# Altium project 机器人.PrjPcb
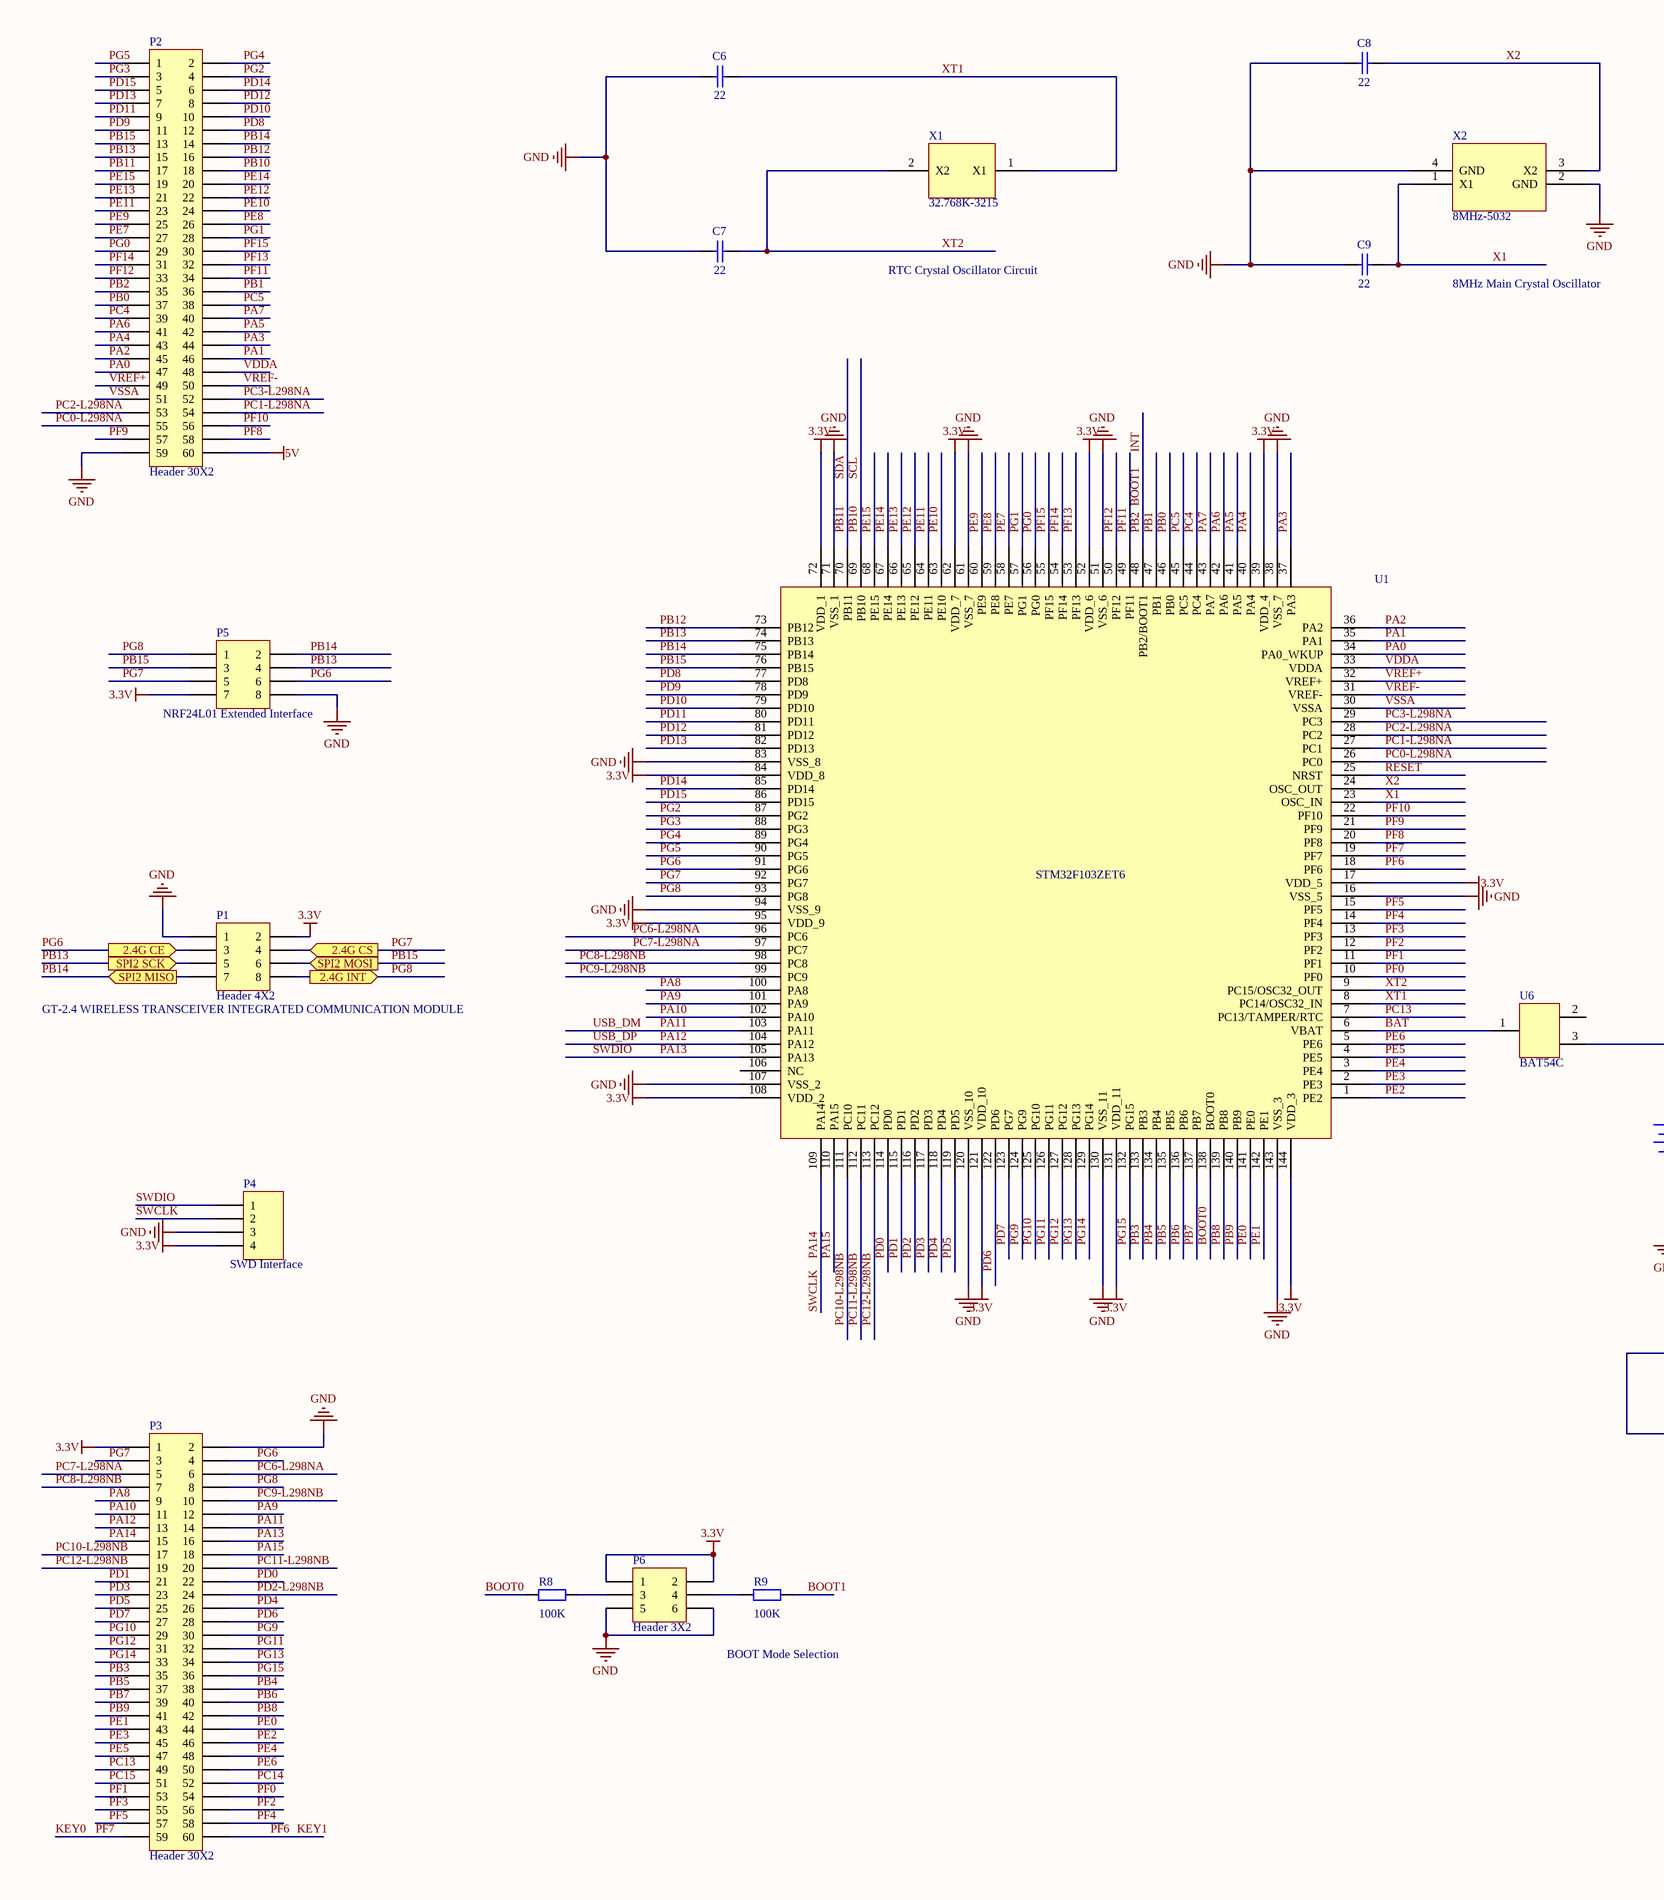
[diagram p0: 核心开发板.SchDoc, left]
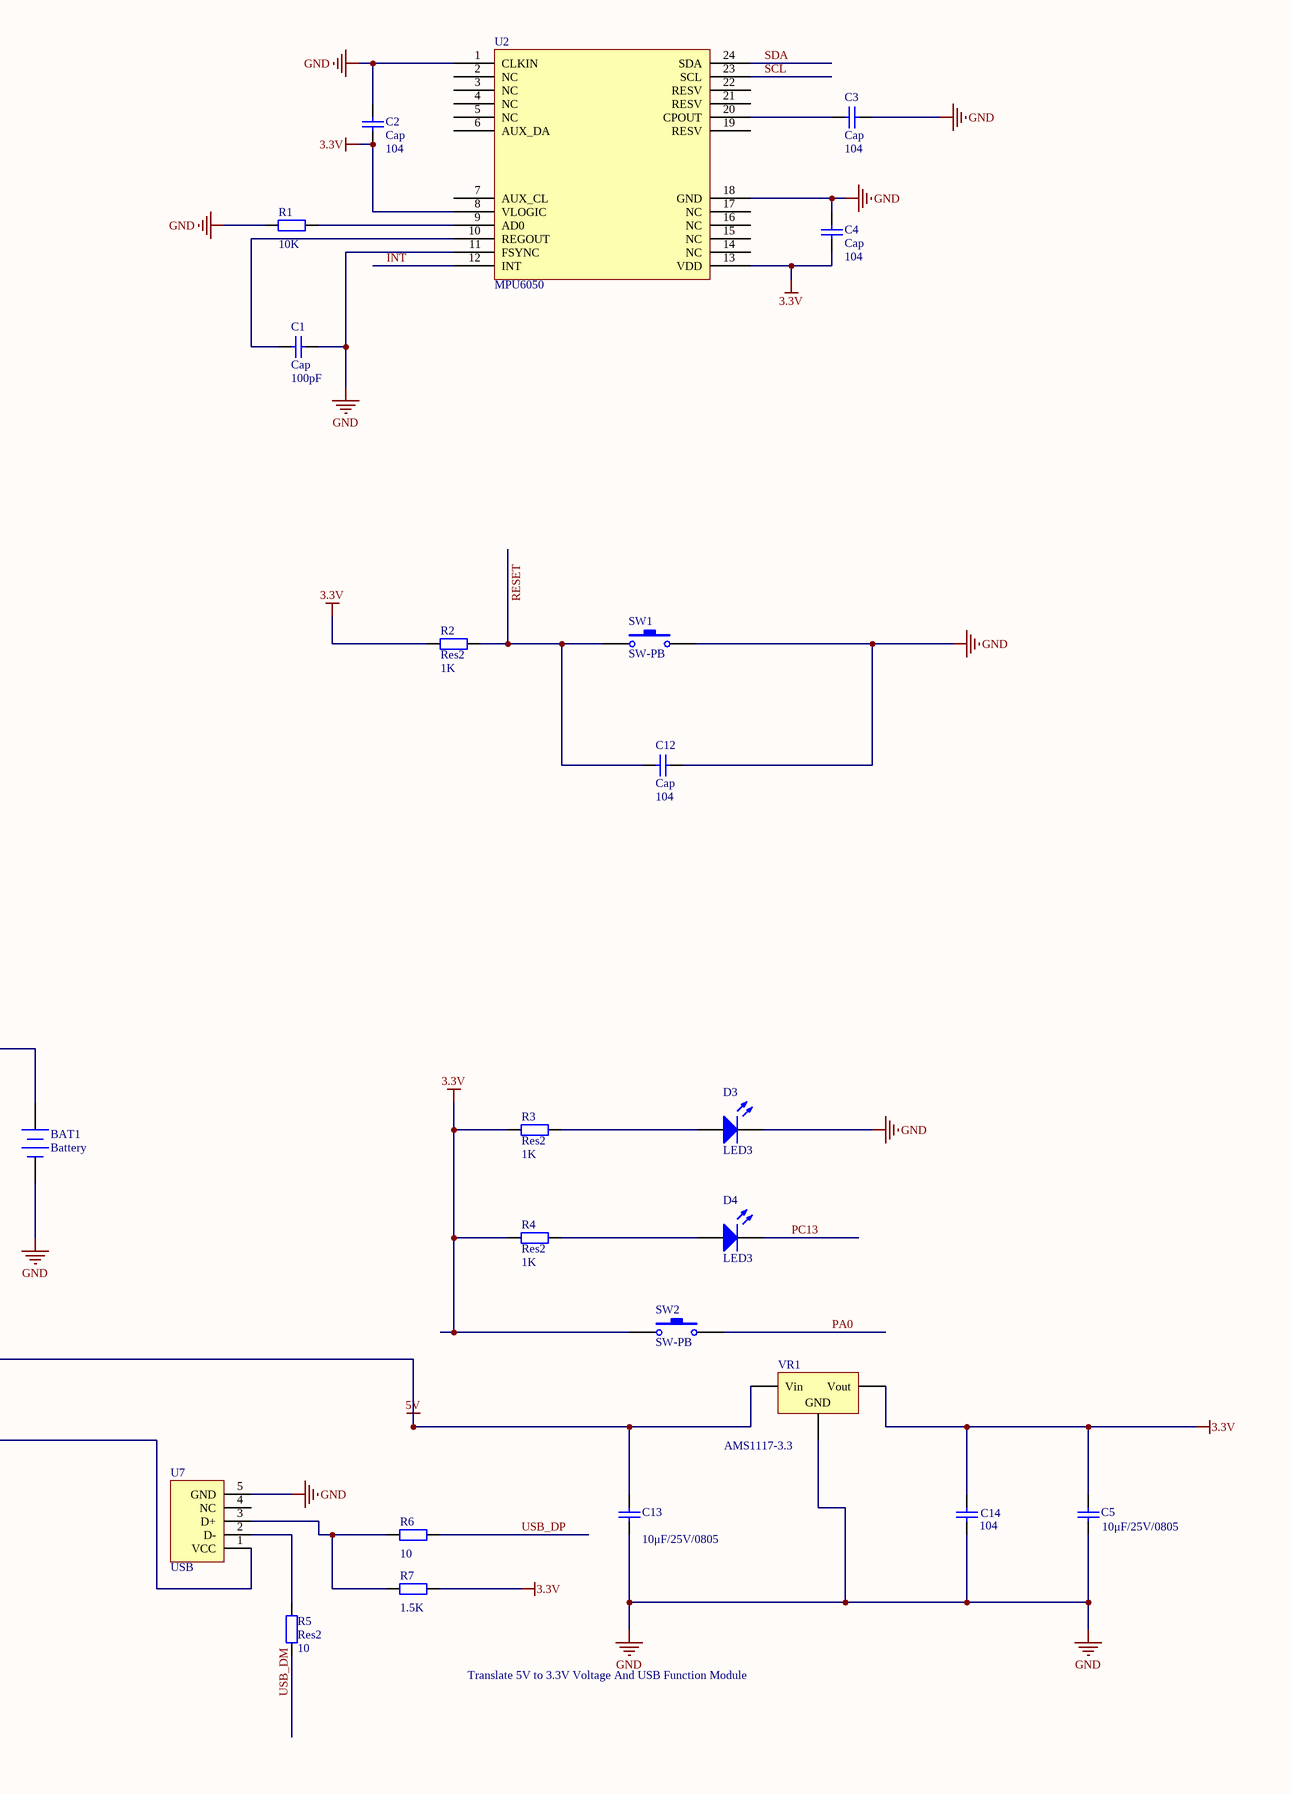
[diagram p1: 核心开发板.SchDoc, right]
2 sheets, 69 parts. Net scope: flat (ports and power ports of the same name join across sheets).
Board files: 开发板.PcbDoc, 驱动板.PcbDoc, 通信板.PcbDoc
Sheets:
  核心开发板.SchDoc
  嵌入式驱动模块.SchDoc

## Sheet 核心开发板.SchDoc
size A2

### Parts
BAT1  Battery  [HDR1X2]
C1  Cap  value 100pF  [0805_C]
C2  Cap  value 104  [0805_C]
C3  Cap  value 104  [0805_C]
C4  Cap  value 104  [0805_C]
C5  value 10μF/25V/0805  [0805_C]  (hidden comment: Cap)
C6  value 22  [0805_C]  (hidden comment: Cap)
C7  value 22  [0805_C]  (hidden comment: Cap)
C8  value 22  [0805_C]  (hidden comment: Cap)
C9  value 22  [0805_C]  (hidden comment: Cap)
C12  Cap  value 104  [0805_C]
C13  value 10μF/25V/0805  [0805_C]  (hidden comment: Cap)
C14  value 104  [0805_C]  (hidden comment: Cap)
D3  LED3  [0805_LED_S1]
D4  LED3  [0805_LED_S1]
P1  Header 4X2  [HDR-4X2]
P2  Header 30X2  [HDR2X30]
P3  Header 30X2  [HDR2X30]
P4  SWD Interface  [HDR-1X4]
P5  NRF24L01 Extended Interface  [HDR-4X2]
P6  Header 3X2  [HDR-3X2]
R1  value 10K  [0805_R]  (hidden comment: Res2)
R2  Res2  value 1K  [0805_R]
R3  Res2  value 1K  [0805_R]
R4  Res2  value 1K  [0805_R]
R5  Res2  value 10  [0805_R]
R6  value 10  [0805_R]  (hidden comment: Res2)
R7  value 1.5K  [0805_R]  (hidden comment: Res2)
R8  value 100K  [0805_R]  (hidden comment: Res2)
R9  value 100K  [0805_R]  (hidden comment: Res2)
SW1  SW-PB  [BUTTON_6*6]
SW2  SW-PB  [BUTTON_6*6]
U1  Component_1  [LQFP-144_20x20x05P]  (value not drawn)
U2  MPU6050  [MPU-6050]
U6  BAT54C  [BAT54C]
U7  USB  [USB-MICRO]
VR1  AMS1117-3.3  [1117]
X1  32.768K-3215  [XTAL-3215]
X2  8MHz-5032  [XTAL-5032]

### Ports
2.4G CE, 2.4G CS, 2.4G INT, SPI2 MISO, SPI2 MOSI, SPI2 SCK

### Nets
3.3V: C2.1 C4.1 C5.2 C14.2 P1.2 P3.1 P4.4 P5.7 P6.1 P6.2 R2.1 R3.1 R4.1 R7.2 SW2.1 U1.17(VDD_5) U1.39(VDD_4) U1.52(VDD_6) U1.62(VDD_7) U1.72(VDD_1) U1.84(VDD_8) U1.95(VDD_9) U1.108(VDD_2) U1.121(VDD_10) U1.131(VDD_11) U1.144(VDD_3) U2.8(VLOGIC) U2.13(VDD) VR1.2(Vout)
5V: C13.2 P2.60 U7.1(VCC) VR1.3(Vin)
GND: BAT1.2(-) C1.2 C2.2 C3.2 C4.2 C5.1 C6.1 C7.1 C8.1 C9.1 C12.2 C13.1 C14.1 D3.2(K) P1.1 P2.59 P3.2 P4.3 P5.8 P6.5 P6.6 R1.1 SW1.2 U1.16(VSS_5) U1.38(VSS_7) U1.51(VSS_6) U1.61(VSS_7) U1.71(VSS_1) U1.83(VSS_8) U1.94(VSS_9) U1.107(VSS_2) U1.120(VSS_10) U1.130(VSS_11) U1.143(VSS_3) U2.1(CLKIN) U2.11(FSYNC) U2.18(GND) U7.5(GND) VR1.1(GND) X2.2(GND) X2.4(GND)
BAT: U1.6(VBAT) U6.1(VDD-4)
BOOT0: R8.1 U1.138(BOOT0)
BOOT1: P2.35 R9.2 U1.48(PB2/BOOT1) U2.12(INT)  [also labelled INT, PB2]
KEY0: P3.59 U1.19(PF7)  [also labelled PF7]
KEY1: P3.60 U1.18(PF6)  [also labelled PF6]
PA0: P2.47 SW2.2 U1.34(PA0_WKUP)
PA1: P2.46 U1.35(PA1)
PA2: P2.45 U1.36(PA2)
PA3: P2.44 U1.37(PA3)
PA4: P2.43 U1.40(PA4)
PA5: P2.42 U1.41(PA5)
PA6: P2.41 U1.42(PA6)
PA7: P2.40 U1.43(PA7)
PA8: P3.9 U1.100(PA8)
PA9: P3.12 U1.101(PA9)
PA10: P3.11 U1.102(PA10)
PA11: P3.14 R5.1 U1.103(PA11)  [also labelled USB_DM]
PA12: P3.13 R6.2 U1.104(PA12)  [also labelled USB_DP]
PA13: P3.16 P4.1 U1.105(PA13)  [also labelled SWDIO]
PA14: P3.15 P4.2 U1.109(PA14)  [also labelled SWCLK]
PA15: P3.18 U1.110(PA15)
PB0: P2.37 U1.46(PB0)
PB1: P2.36 U1.47(PB1)
PB3: P3.35 U1.133(PB3)
PB4: P3.38 U1.134(PB4)
PB5: P3.37 U1.135(PB5)
PB6: P3.40 U1.136(PB6)
PB7: P3.39 U1.137(PB7)
PB8: P3.42 U1.139(PB8)
PB9: P3.41 U1.140(PB9)
PB10: P2.18 U1.69(PB10) U2.23(SCL)  [also labelled SCL]
PB11: P2.17 U1.70(PB11) U2.24(SDA)  [also labelled SDA]
PB12: P2.16 U1.73(PB12)
PB13: P1.5 P2.15 P5.4 U1.74(PB13) ; port SPI2 SCK
PB14: P1.7 P2.14 P5.2 U1.75(PB14) ; port SPI2 MISO
PB15: P1.6 P2.13 P5.3 U1.76(PB15) ; port SPI2 MOSI
PC0-L298NA: P2.55 U1.26(PC0)
PC1-L298NA: P2.54 U1.27(PC1)
PC2-L298NA: P2.53 U1.28(PC2)
PC3-L298NA: P2.52 U1.29(PC3)
PC4: P2.39 U1.44(PC4)
PC5: P2.38 U1.45(PC5)
PC6-L298NA: P3.6 U1.96(PC6)
PC7-L298NA: P3.5 U1.97(PC7)
PC8-L298NB: P3.7 U1.98(PC8)
PC9-L298NB: P3.10 U1.99(PC9)
PC10-L298NB: P3.17 U1.111(PC10)
PC11-L298NB: P3.20 U1.112(PC11)
PC12-L298NB: P3.19 U1.113(PC12)
PC13: D4.2(K) P3.49 U1.7(PC13/TAMPER/RTC)
PC14: P3.52
PC15: P3.51
PD0: P3.22 U1.114(PD0)
PD1: P3.21 U1.115(PD1)
PD2: U1.116(PD2)
PD2-L298NB: P3.24
PD3: P3.23 U1.117(PD3)
PD4: P3.26 U1.118(PD4)
PD5: P3.25 U1.119(PD5)
PD6: P3.28 U1.122(PD6)
PD7: P3.27 U1.123(PG7)
PD8: P2.12 U1.77(PD8)
PD9: P2.11 U1.78(PD9)
PD10: P2.10 U1.79(PD10)
PD11: P2.9 U1.80(PD11)
PD12: P2.8 U1.81(PD12)
PD13: P2.7 U1.82(PD13)
PD14: P2.6 U1.85(PD14)
PD15: P2.5 U1.86(PD15)
PE0: P3.44 U1.141(PE0)
PE1: P3.43 U1.142(PE1)
PE2: P3.46 U1.1(PE2)
PE3: P3.45 U1.2(PE3)
PE4: P3.48 U1.3(PE4)
PE5: P3.47 U1.4(PE5)
PE6: P3.50 U1.5(PE6)
PE7: P2.27 U1.58(PE7)
PE8: P2.26 U1.59(PE8)
PE9: P2.25 U1.60(PE9)
PE10: P2.24 U1.63(PE10)
PE11: P2.23 U1.64(PE11)
PE12: P2.22 U1.65(PE12)
PE13: P2.21 U1.66(PE13)
PE14: P2.20 U1.67(PE14)
PE15: P2.19 U1.68(PE15)
PF0: P3.54 U1.10(PF0)
PF1: P3.53 U1.11(PF1)
PF2: P3.56 U1.12(PF2)
PF3: P3.55 U1.13(PF3)
PF4: P3.58 U1.14(PF4)
PF5: P3.57 U1.15(PF5)
PF8: P2.58 U1.20(PF8)
PF9: P2.57 U1.21(PF9)
PF10: P2.56 U1.22(PF10)
PF11: P2.34 U1.49(PF11)
PF12: P2.33 U1.50(PF12)
PF13: P2.32 U1.53(PF13)
PF14: P2.31 U1.54(PF14)
PF15: P2.30 U1.55(PF15)
PG0: P2.29 U1.56(PG0)
PG1: P2.28 U1.57(PG1)
PG2: P2.4 U1.87(PG2)
PG3: P2.3 U1.88(PG3)
PG4: P2.2 U1.89(PG4)
PG5: P2.1 U1.90(PG5)
PG6: P1.3 P3.4 P5.6 U1.91(PG6) ; port 2.4G CE
PG7: P1.4 P3.3 P5.5 U1.92(PG7) ; port 2.4G CS
PG8: P1.8 P3.8 P5.1 U1.93(PG8) ; port 2.4G INT
PG9: P3.30 U1.124(PG9)
PG10: P3.29 U1.125(PG10)
PG11: P3.32 U1.126(PG11)
PG12: P3.31 U1.127(PG12)
PG13: P3.34 U1.128(PG13)
PG14: P3.33 U1.129(PG14)
PG15: P3.36 U1.132(PG15)
RESET: C12.1 R2.2 SW1.1 U1.25(NRST)
VDDA: P2.48 U1.33(VDDA)
VREF+: P2.49 U1.32(VREF+)
VREF-: P2.50 U1.31(VREF-)
VSSA: P2.51 U1.30(VSSA)
X1: C9.2 U1.23(OSC_IN) X2.1(X1)
X2: C8.2 U1.24(OSC_OUT) X2.3(X2)
XT1: C6.2 U1.8(PC14/OSC32_IN) X1.1(X1)
XT2: C7.2 U1.9(PC15/OSC32_OUT) X1.2(X2)
NetBAT1_1: BAT1.1(+) U6.3
NetC1_1: C1.1 U2.10(REGOUT)
NetC3_1: C3.1 U2.20(CPOUT)
NetD3_1: D3.1(A) R3.2
NetD4_1: D4.1(A) R4.2
NetP6_3: P6.3 R8.2
NetP6_4: P6.4 R9.1
NetR1_2: R1.2 U2.9(AD0)
NetR5_2: R5.2 U7.2(D-)
NetR6_1: R6.1 R7.1 U7.3(D+)

Not connected (* = marked no-connect by the designer): U1 106(NC); U2 2(NC) 3(NC) 4(NC) 5(NC) 6(AUX_DA) 7(AUX_CL) 14(NC) 15(NC) 16(NC) 17(NC) 19(RESV) 21(RESV) 22(RESV); U6 2(VDD-5); U7 4(NC)

### Notes on the sheet
- RTC Crystal Oscillator Circuit
- 8MHz Main Crystal Oscillator
- (near P1) GT-2.4 WIRELESS TRANSCEIVER INTEGRATED COMMUNICATION MODULE
- BOOT Mode Selection
- Translate 5V to 3.3V Voltage And USB Function Module
- (in symbol Component_1) STM32F103ZET6

### Library data of the parts
BAT1 = Battery: Multicell Battery; Published: 24-Mar-1999; LatestRevisionDate: 17-Jul-2002; LatestRevisionNote: Re-released for DXP Platform.; PackageReference: BAT-2; Publisher: Altium Limited; PackageDescription: Battery; 2 Leads
C1-C9 C12-C14 = Cap: Capacitor; Published: 8-Jun-2000; LatestRevisionDate: 17-Jul-2002; LatestRevisionNote: Re-released for DXP Platform.; PackageReference: RAD-0.3; Publisher: Altium Limited; PackageDescription: Radial Cap, Thru-Hole; 2 Leads; 0.3 in Pin Spacing
D3 D4 = LED3: Typical BLUE SiC LED; Published: 8-Jun-2000; LatestRevisionDate: 17-Dec-2003; LatestRevisionNote: PCB Footprint replaced.; DatasheetVersion: 16-Apr-2002; PackageVersion: 16-Apr-2002; PackageReference: 3.5X2.8X1.9; Publisher: Altium Limited; PackageDescription: SM LED; 2 C-Bend Leads; Body 3.5 x 2.8 x 1.9 mm, inc leads (LxWxH typ)
P1 = Header 4X2: Header, 4-Pin, Dual row; LatestRevisionDate: 17-Jul-2002; LatestRevisionNote: Re-released for DXP Platform.; Publisher: Altium Limited
P2 P3 = Header 30X2: Header, 30-Pin, Dual row; LatestRevisionDate: 17-Jul-2002; LatestRevisionNote: Re-released for DXP Platform.; Publisher: Altium Limited
P4 = MHDR1X4: Header, 4-Pin; LatestRevisionDate: 17-Jul-2002; LatestRevisionNote: Re-released for DXP Platform.; Publisher: Altium Limited
P5 = MHDR2X4: Header, 4-Pin, Dual row; LatestRevisionDate: 17-Jul-2002; LatestRevisionNote: Re-released for DXP Platform.; Publisher: Altium Limited
P6 = Header 3X2: Header, 3-Pin, Dual row; LatestRevisionDate: *; LatestRevisionNote: *; Publisher: *
R1-R9 = Res2: Resistor; Published: 8-Jun-2000; LatestRevisionDate: 17-Jul-2002; LatestRevisionNote: Re-released for DXP Platform.; PackageReference: AXIAL-0.4; Publisher: Altium Limited
  R1-R7: PackageDescription: Axial Device, Thru-Hole; 2 Leads; 0.4 in Pin Spacing
SW1 SW2 = SW-PB: Switch; Published: 24-Mar-1999; LatestRevisionDate: 17-Jul-2002; LatestRevisionNote: Re-released for DXP Platform.; PackageReference: SPST-2; Publisher: Altium Limited; PackageDescription: Switch; 2 Leads
U2 X1 X2 = Component_1
VR1 = AMS1117-3.3 SOT-223: 低压差线性稳压(LDO); ComponentLink1Description: 供应商链接; ComponentLink1URL: http://www.szlcsc.com/product/details_6652.html; Package: SOT-223; Supplier: LC; SuppliersPartNumber: C6186

## Sheet 嵌入式驱动模块.SchDoc
size A2
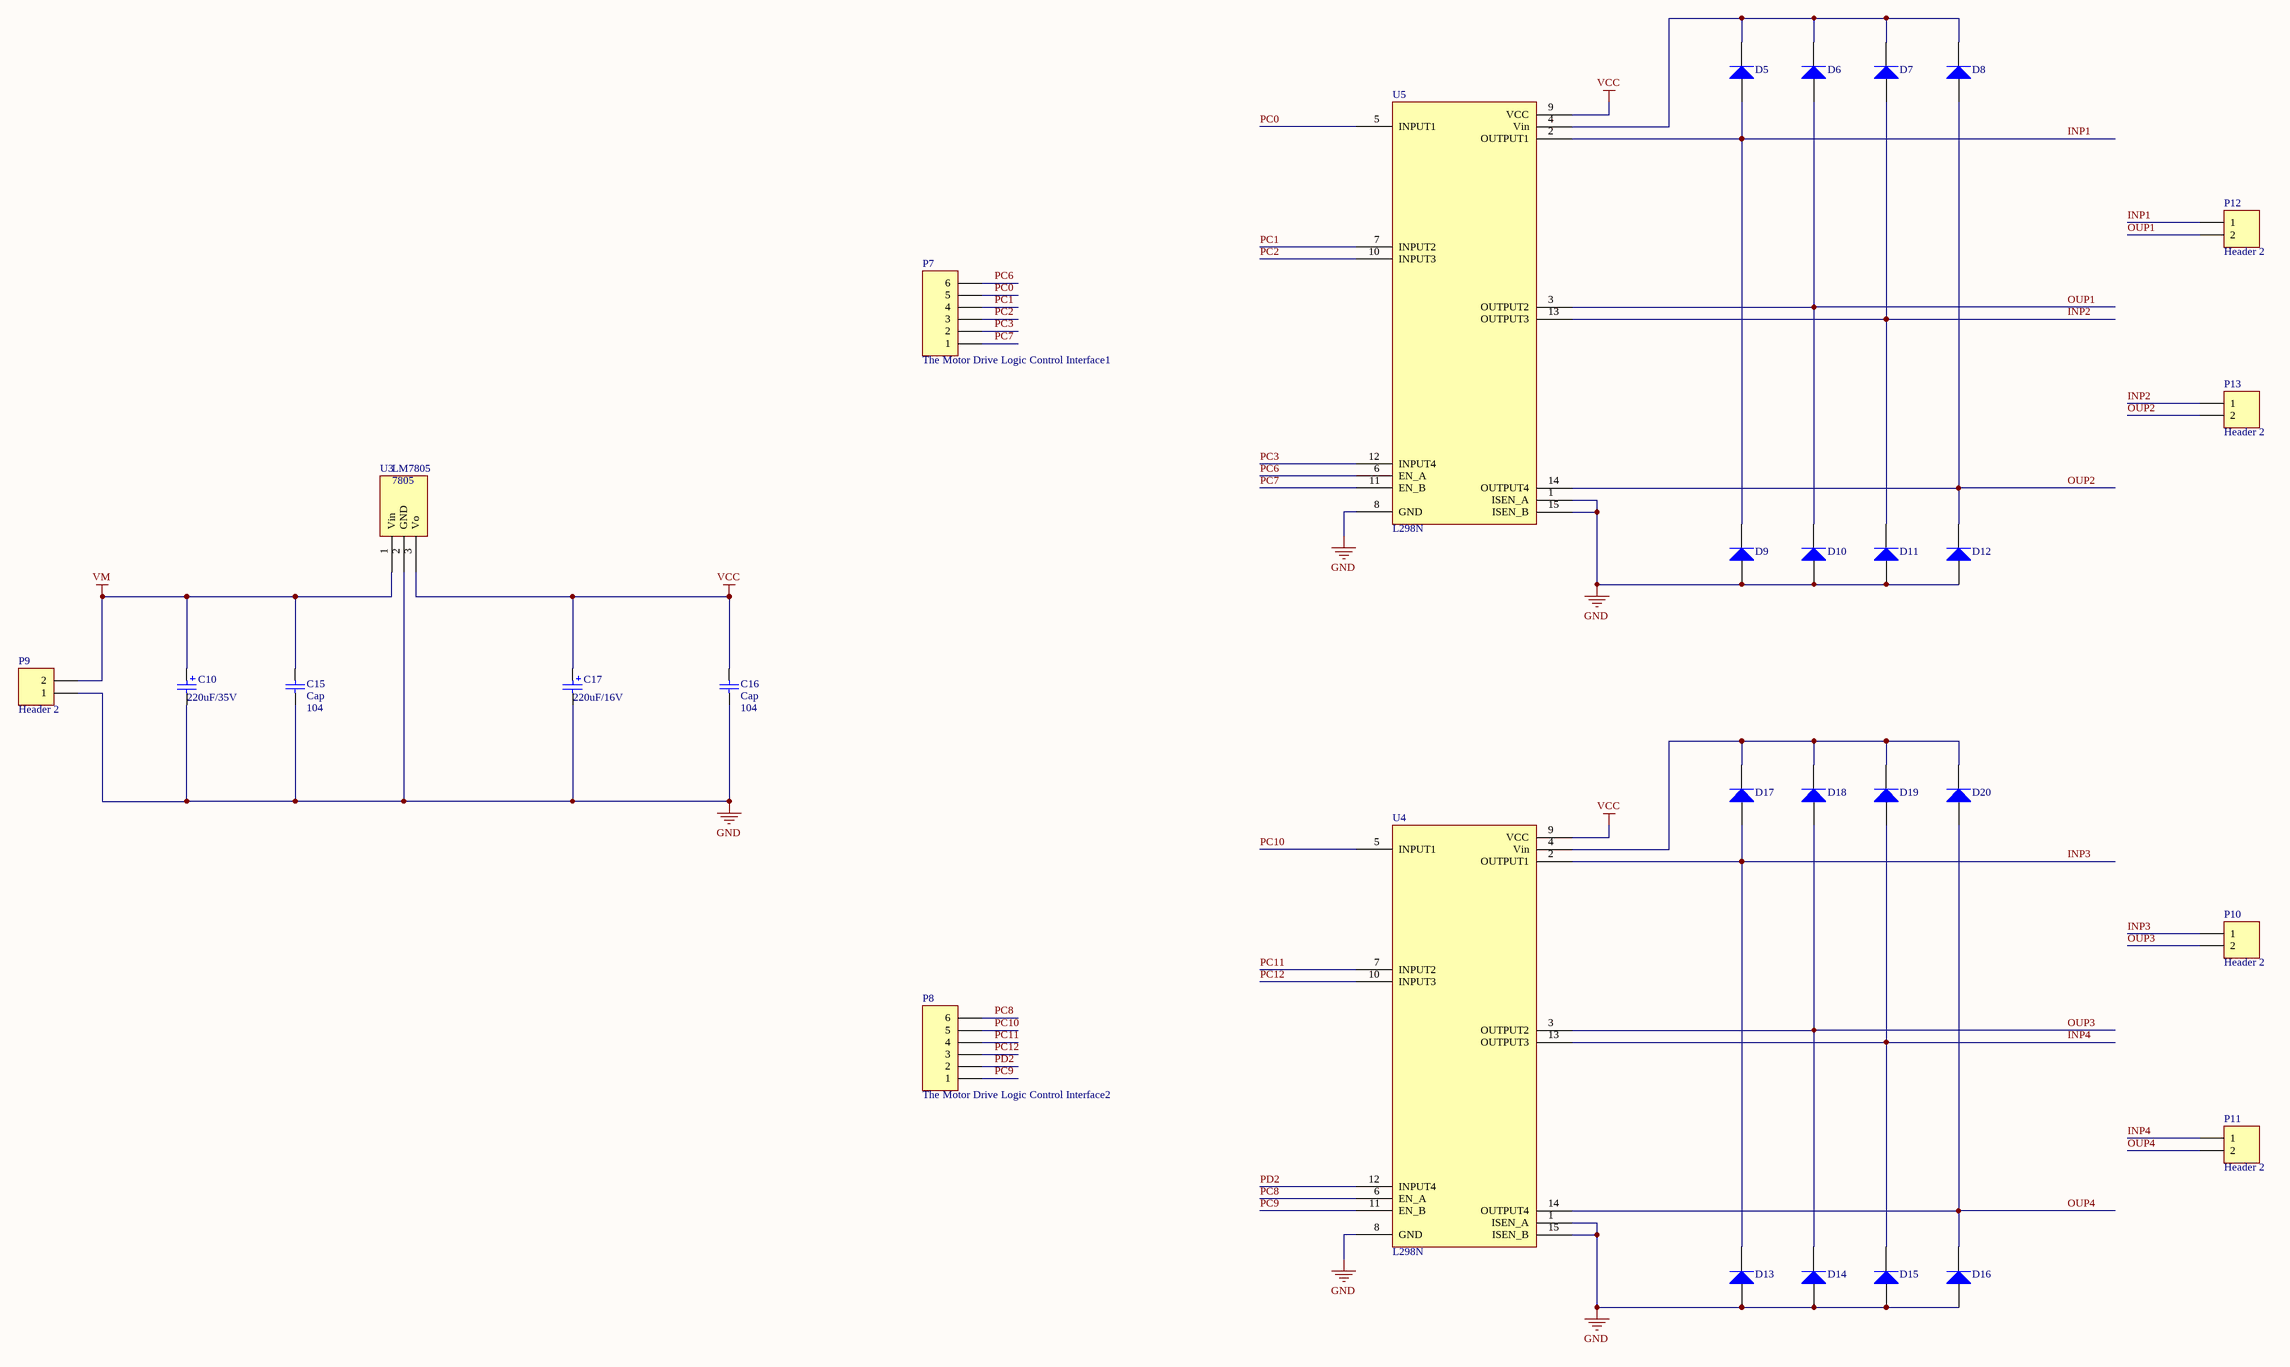
[diagram p2: 嵌入式驱动模块.SchDoc]

### Parts
C10  value 220uF/35V  [RB 5/10]  (hidden comment: Cap Pol2)
C15  Cap  value 104  [CAP-0.1]
C16  Cap  value 104  [CAP-0.1]
C17  value 220uF/16V  [RB 5/10]  (hidden comment: Cap Pol2)
D5  (no value)  [DO-41]
D6  Diode 1N914  [DO-41]  (value not drawn)
D7  Diode 1N914  [DO-41]  (value not drawn)
D8  (no value)  [DO-41]
D9  Diode 1N914  [DO-41]  (value not drawn)
D10  Diode 1N914  [DO-41]  (value not drawn)
D11  Diode 1N914  [DO-41]  (value not drawn)
D12  Diode 1N914  [DO-41]  (value not drawn)
D13  Diode 1N914  [DO-41]  (value not drawn)
D14  Diode 1N914  [DO-41]  (value not drawn)
D15  Diode 1N914  [DO-41]  (value not drawn)
D16  Diode 1N914  [DO-41]  (value not drawn)
D17  (no value)  [DO-41]
D18  Diode 1N914  [DO-41]  (value not drawn)
D19  Diode 1N914  [DO-41]  (value not drawn)
D20  (no value)  [DO-41]
P7  The Motor Drive Logic Control Interface1  [HDR-1X6]
P8  The Motor Drive Logic Control Interface2  [HDR-1X6]
P9  Header 2  [KF301-2P]
P10  Header 2  [KF301-2P]
P11  Header 2  [KF301-2P]
P12  Header 2  [KF301-2P]
P13  Header 2  [KF301-2P]
U3  LM7805  [TO-220(TO-220-3)]
U4  L298N  [L298]
U5  L298N  [L298]

### Nets
GND: C10.2 C15.1 C16.1 C17.2 D9.1(A) D10.1(A) D11.1(A) D12.1(A) D13.1(A) D14.1(A) D15.1(A) D16.1(A) P9.1 U3.2(GND) U4.1(ISEN_A) U4.8(GND) U4.15(ISEN_B) U5.1(ISEN_A) U5.8(GND) U5.15(ISEN_B)
VCC: C16.2 C17.1 U3.3(Vo) U4.9(VCC) U5.9(VCC)
VM: C10.1 C15.2 P9.2 U3.1(Vin)
INP1: D5.1(A) D9.2(K) P12.1 U5.2(OUTPUT1)
INP2: D7.1(A) D11.2(K) P13.1 U5.13(OUTPUT3)
INP3: D13.2(K) D17.1(A) P10.1 U4.2(OUTPUT1)
INP4: D15.2(K) D19.1(A) P11.1 U4.13(OUTPUT3)
OUP1: D6.1(A) D10.2(K) P12.2 U5.3(OUTPUT2)
OUP2: D8.1(A) D12.2(K) P13.2 U5.14(OUTPUT4)
OUP3: D14.2(K) D18.1(A) P10.2 U4.3(OUTPUT2)
OUP4: D16.2(K) D20.1(A) P11.2 U4.14(OUTPUT4)
PC0: P7.5 U5.5(INPUT1)
PC1: P7.4 U5.7(INPUT2)
PC2: P7.3 U5.10(INPUT3)
PC3: P7.2 U5.12(INPUT4)
PC6: P7.6 U5.6(EN_A)
PC7: P7.1 U5.11(EN_B)
PC8: P8.6 U4.6(EN_A)
PC9: P8.1 U4.11(EN_B)
PC10: P8.5 U4.5(INPUT1)
PC11: P8.4 U4.7(INPUT2)
PC12: P8.3 U4.10(INPUT3)
PD2: P8.2 U4.12(INPUT4)
NetD5_2: D5.2(K) D6.2(K) D7.2(K) D8.2(K) U5.4(Vin)
NetD17_2: D17.2(K) D18.2(K) D19.2(K) D20.2(K) U4.4(Vin)

### Notes on the sheet
- (in symbol Component_1) 7805

### Library data of the parts
C10 C17 = Cap Pol2: Polarized Capacitor (Axial); Published: 8-Jun-2000; LatestRevisionDate: 17-Jul-2002; LatestRevisionNote: Re-released for DXP Platform.; PackageReference: POLAR0.8; Publisher: Altium Limited; PackageDescription: Polarized Capacitor; 2 Leads
C15 C16 = Cap: Capacitor; Published: 8-Jun-2000; LatestRevisionDate: 17-Jul-2002; LatestRevisionNote: Re-released for DXP Platform.; PackageReference: RAD-0.3; Publisher: Altium Limited; PackageDescription: Radial Cap, Thru-Hole; 2 Leads; 0.3 in Pin Spacing
D5-D20 = Diode 1N914: High Conductance Fast Diode; Published: 8-Jun-2000; LatestRevisionDate: 17-Jul-2002; LatestRevisionNote: Re-released for DXP Platform.; DatasheetVersion: 1997; PackageReference: DO-35; Publisher: Altium Limited; PackageDescription: Diode, Axial; Body 3.8 x 1.9 mm (LxDia. max), Lead Dia. 0.53 mm (max); Code_JEDEC: DO-204-AH; ComponentLink1Description: Manufacturer Link; ComponentLink1URL: http://www.fairchildsemi.com/; ComponentLink2Description: Datasheet; ComponentLink2URL: http://www.fairchildsemi.com/ds/1N%2F1N4448.pdf
P7 P8 = Header 6: Header, 6-Pin; LatestRevisionDate: 17-Jul-2002; LatestRevisionNote: Re-released for DXP Platform.; Publisher: Altium Limited
P9-P13 = Header 2: Header, 2-Pin; LatestRevisionDate: 17-Jul-2002; LatestRevisionNote: Re-released for DXP Platform.; Publisher: Altium Limited
U3-U5 = Component_1

## Nets that join several sheets
GND: 核心开发板 (41 pins), 嵌入式驱动模块 (20 pins)